# EAGLE design power-control (EAGLE 6.4)
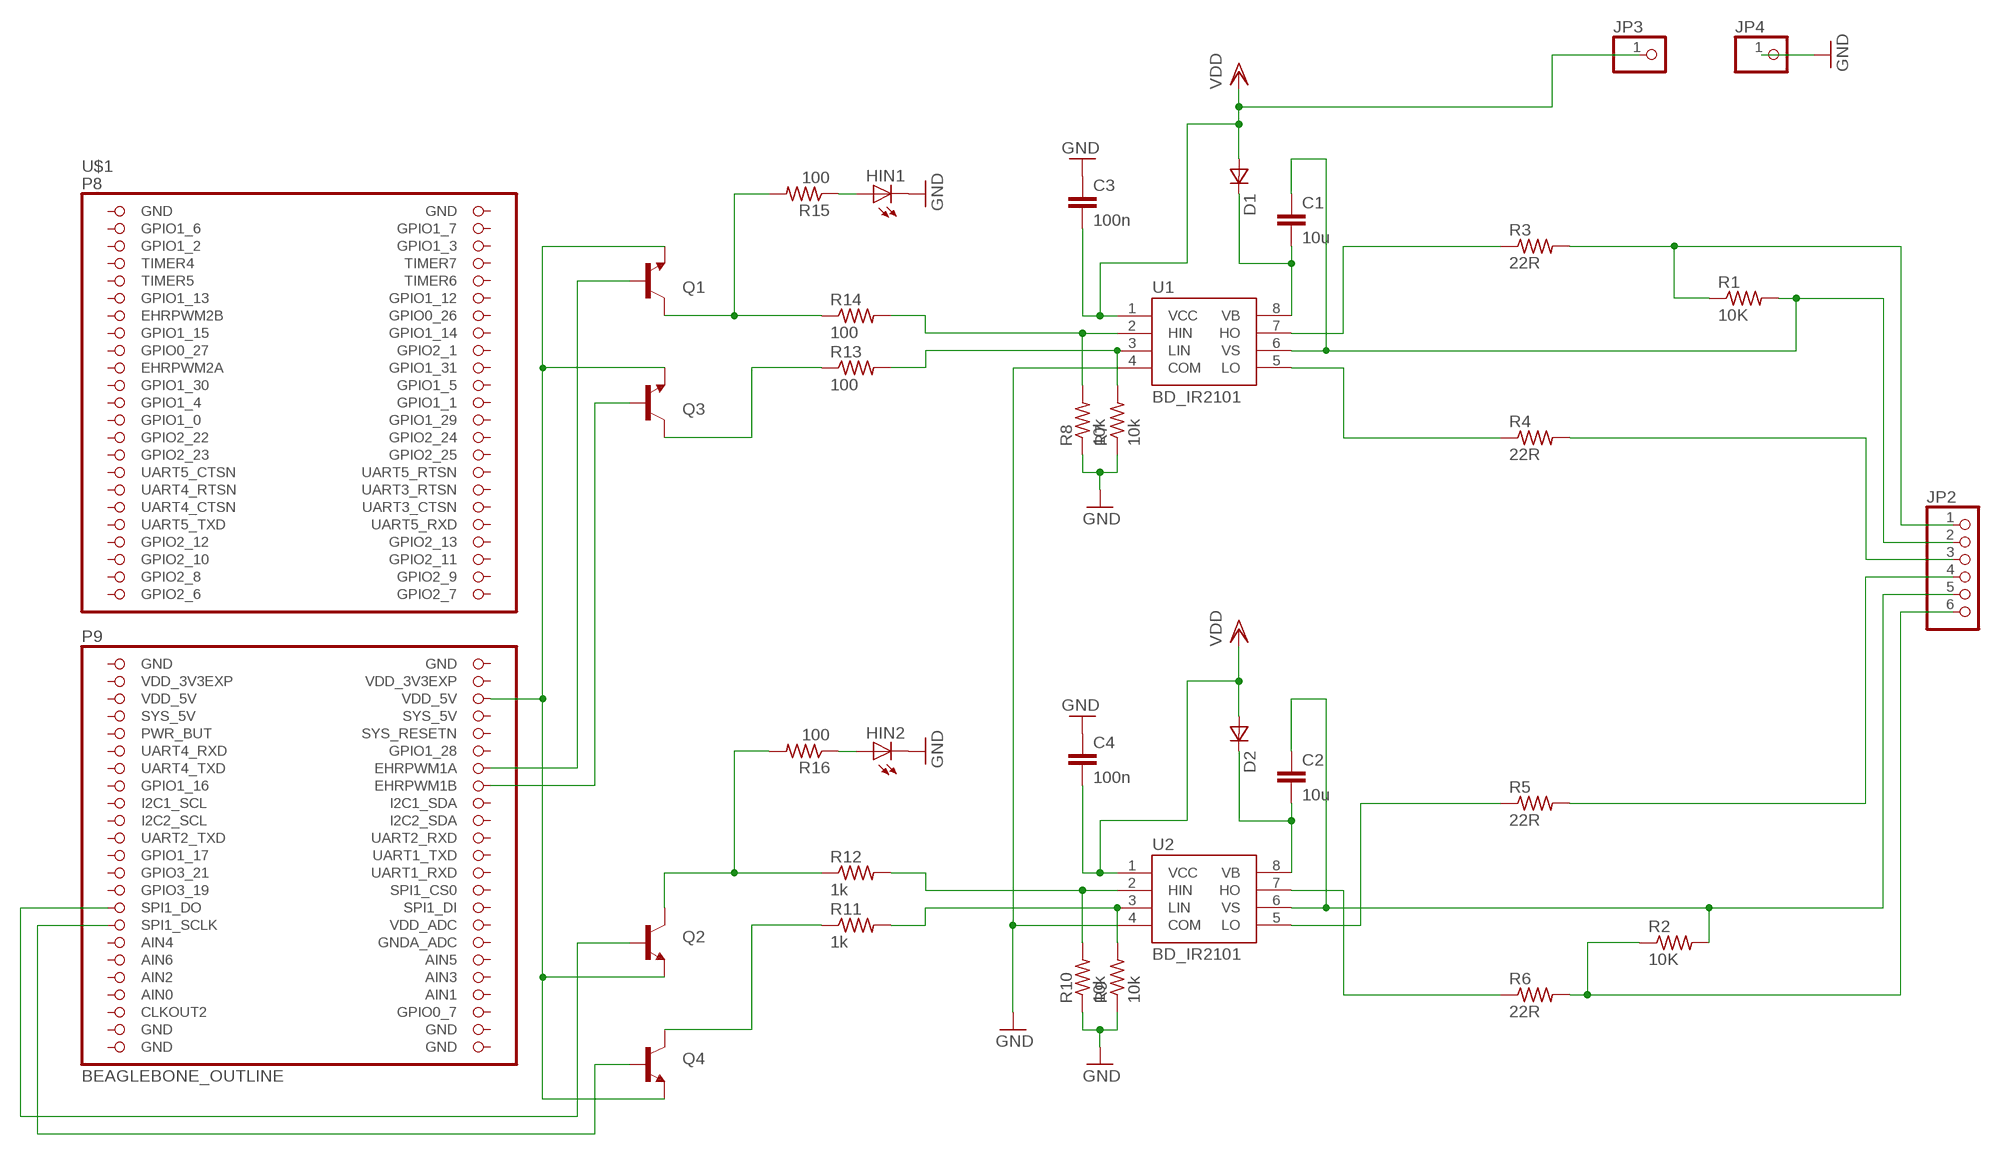
[diagram p0: schematic, sheet 1]

## Parts
C1  10u  C-EUC0603  [C0603]
C2  10u  C-EUC0603  [C0603]
C3  100n  C-EUC0603  [C0603]
C4  100n  C-EUC0603  [C0603]
D1  DSOT23  [SOT-23]
D2  DSOT23  [SOT-23]
HIN1  LEDCHIPLED_0603  [CHIPLED_0603]
HIN2  LEDCHIPLED_0603  [CHIPLED_0603]
JP2  PINHD-1X6  [1X06]
JP3  PINHD-1X1  [1X01]
JP4  PINHD-1X1  [1X01]
Q1  TRANSISTOR_NPNSOT23-3  [SOT23-3]
Q2  TRANSISTOR_NPNSOT23-3  [SOT23-3]
Q3  TRANSISTOR_NPNSOT23-3  [SOT23-3]
Q4  TRANSISTOR_NPNSOT23-3  [SOT23-3]
R1  10K  R-US_R0603  [R0603]
R2  10K  R-US_R0603  [R0603]
R3  22R  R-US_R0603  [R0603]
R4  22R  R-US_R0603  [R0603]
R5  22R  R-US_R0603  [R0603]
R6  22R  R-US_R0603  [R0603]
R7  10k  R-US_R0603  [R0603]
R8  10k  R-US_R0603  [R0603]
R9  10k  R-US_R0603  [R0603]
R10  10k  R-US_R0603  [R0603]
R11  1k  R-US_R0603  [R0603]
R12  1k  R-US_R0603  [R0603]
R13  100  R-US_R0603  [R0603]
R14  100  R-US_R0603  [R0603]
R15  100  R-US_R0603  [R0603]
R16  100  R-US_R0603  [R0603]
U1  BD_IR2101  [SO8]
U2  BD_IR2101  [SO8]
U$1  BEAGLEBONE_OUTLINE  [BEAGLEBONE_SHIELD]

## Nets
GND: C3.1 C4.1 HIN1.C HIN2.C JP4.1 R7.1 R8.1 R9.1 R10.1 U1.4(COM) U2.4(COM)
HO_1: R3.1 U1.7(HO)
HO_2: R6.1 U2.7(HO)
LO_1: R4.1 U1.5(LO)
LO_2: R5.1 U2.5(LO)
MOTOR_OUT_1: C1.1 JP2.2 R1.2 U1.6(VS)
MOTOR_OUT_2: C2.1 JP2.5 R2.2 U2.6(VS)
N$1: Q1.1(B) U$1.60(EHRPWM1A)
N$2: Q4.1(B) U$1.77(SPI1_SCLK)
N$3: R8.2 R14.2 U1.2(HIN)
N$4: R7.2 R13.2 U1.3(LIN)
N$5: R10.2 R12.2 U2.2(HIN)
N$6: R9.2 R11.2 U2.3(LIN)
N$7: C1.2 D1.1(C) U1.8(VB)
N$8: C2.2 D2.1(C) U2.8(VB)
N$10: JP2.4 R5.2
N$11: Q3.3(C) R13.1
N$12: Q3.1(B) U$1.62(EHRPWM1B)
N$13: Q2.1(B) U$1.75(SPI1_DO)
N$14: HIN1.A R15.1
N$15: JP2.1 R1.1 R3.2
N$16: HIN2.A R16.1
N$17: Q2.3(C) R12.1 R16.2
N$18: Q1.3(C) R14.1 R15.2
N$19: Q4.3(C) R11.1
N$20: JP2.3 R4.2
N$21: Q1.2(E) Q2.2(E) Q3.2(E) Q4.2(E) U$1.52(VDD_5V)
N$25: JP2.6 R2.1 R6.2
VDD: C3.2 C4.2 D1.3(A) D2.3(A) JP3.1 U1.1(VCC) U2.1(VCC)
Unconnected: U$1.3(GPIO1_6) U$1.4(GPIO1_7) U$1.5(GPIO1_2) U$1.6(GPIO1_3) U$1.7(TIMER4) U$1.8(TIMER7) U$1.9(TIMER5) U$1.10(TIMER6) U$1.11(GPIO1_13) U$1.12(GPIO1_12) U$1.13(EHRPWM2B) U$1.14(GPIO0_26) U$1.15(GPIO1_15) U$1.16(GPIO1_14) U$1.17(GPIO0_27) U$1.18(GPIO2_1) U$1.19(EHRPWM2A) U$1.20(GPIO1_31) U$1.21(GPIO1_30) U$1.22(GPIO1_5) U$1.23(GPIO1_4) U$1.24(GPIO1_1) U$1.25(GPIO1_0) U$1.26(GPIO1_29) U$1.27(GPIO2_22) U$1.28(GPIO2_24) U$1.29(GPIO2_23) U$1.30(GPIO2_25) U$1.31(UART5_CTSN) U$1.32(UART5_RTSN) U$1.33(UART4_RTSN) U$1.34(UART3_RTSN) U$1.35(UART4_CTSN) U$1.36(UART3_CTSN) U$1.37(UART5_TXD) U$1.38(UART5_RXD) U$1.39(GPIO2_12) U$1.40(GPIO2_13) U$1.41(GPIO2_10) U$1.42(GPIO2_11) U$1.43(GPIO2_8) U$1.44(GPIO2_9) U$1.45(GPIO2_6) U$1.46(GPIO2_7) U$1.54(SYS_5V) U$1.55(PWR_BUT) U$1.56(SYS_RESETN) U$1.57(UART4_RXD) U$1.58(GPIO1_28) U$1.59(UART4_TXD) U$1.61(GPIO1_16) U$1.63(I2C1_SCL) U$1.64(I2C1_SDA) U$1.65(I2C2_SCL) U$1.66(I2C2_SDA) U$1.67(UART2_TXD) U$1.68(UART2_RXD) U$1.69(GPIO1_17) U$1.70(UART1_TXD) U$1.71(GPIO3_21) U$1.72(UART1_RXD) U$1.73(GPIO3_19) U$1.74(SPI1_CS0) U$1.76(SPI1_DI) U$1.78(VDD_ADC) U$1.79(AIN4) U$1.80(GNDA_ADC) U$1.81(AIN6) U$1.82(AIN5) U$1.83(AIN2) U$1.84(AIN3) U$1.86(AIN1) U$1.87(CLKOUT2) U$1.88(GPIO0_7)

## Power pins joined to a net without a drawn wire
AIN0: U$1.85(AIN0)
GND: U$1.1(GND) U$1.2(GND) U$1.47(GND) U$1.48(GND) U$1.89(GND) U$1.90(GND) U$1.91(GND) U$1.92(GND)
SYS_5V: U$1.53(SYS_5V)
VDD_3V3EXP: U$1.49(VDD_3V3EXP) U$1.50(VDD_3V3EXP)
VDD_5V: U$1.51(VDD_5V)

## Library data of the parts
C1-C4 = rcl:C-EU: CAPACITOR, European symbol
D1 D2 = zetex:D: DIODE; MPN: CDSOT23-T03; OC_FARNELL: 1824866; OC_NEWARK: 75K7096
HIN1 HIN2 = adafruit:LED: LED OSRAM: - CHIPLED LG R971, LG N971, LY N971, LG Q971, LY Q971, LO R971, LY R971 LH N974, LH R974 LS Q976, LO Q976, LY Q976 LO Q996 - Hyper CHIPLED LW Q18S LB Q993, LB Q99A, LB R99A - SideLED LS A670, LO A670, LY A670, LG A670, LP A670 LB A673, LV A673, LT A673, LW A673 LH A674 LY A675 LS A676, LA A676, LO A676, LY A676, LW A676 LS A679, LY A679, LG A679 - Hyper Micro SIDELED® LS Y876, LA Y876, LO Y876, LY Y876 LT Y87S - SmartLED LW L88C, LW L88S LB L89C, LB L89S, LG L890 LS L89K, LO L89K, LY L89K LS L896, LA L896, LO L896, LY L896 - TOPLED LS T670, LO T670, LY T670, LG T670, LP T670 LSG T670, LSP T670, LSY T670, LOP T670, LYG T670 LG T671, LOG T671, LSG T671 LB T673, LV T673, LT T673, LW T673 LH T674 LS T676, LA T676, LO T676, LY T676, LB T676, LH T676, LSB T676, LW T676 LB T67C, LV T67C, LT T67C, LS T67K, LO T67K, LY T67K, LW E67C LS E67B, LA E67B, LO E67B, LY E67B, LB E67C, LV E67C, LT E67C LW T67C LS T679, LY T679, LG T679 LS T770, LO T770, LY T770, LG T770, LP T770 LB T773, LV T773, LT T773, LW T773 LH T774 LS E675, LA E675, LY E675, LS T675 LS T776, LA T776, LO T776, LY T776, LB T776 LHGB T686 LT T68C, LB T68C - Hyper Mini TOPLED® LB M676 - Mini TOPLED Santana® LG M470 LS M47K, LO M47K, LY M47K Source: http://www.osram.convergy.de/
JP2 = pinhead:PINHD-1X6: PIN HEADER
JP3 JP4 = pinhead:PINHD-1X1: PIN HEADER
Q1-Q4 = SparkFun-DiscreteSemi:TRANSISTOR_NPN: Generic NPN BJT MMBT2222A - TRANS-08049 (SOT-23, 1A 40V) MPSA42 - TRANS-09116 (SOT-23, 500mA 300V) MMBT5088LT1G - TRANS-11160 (SOT-23, 50 mA 30V)
R1-R16 = rcl:R-US_: RESISTOR, American symbol
U1 U2 = open-bldc:BD
U$1 = adafruit:BEAGLEBONE_OUTLINE: Should match A3 pinout - but not completely tested

## Board
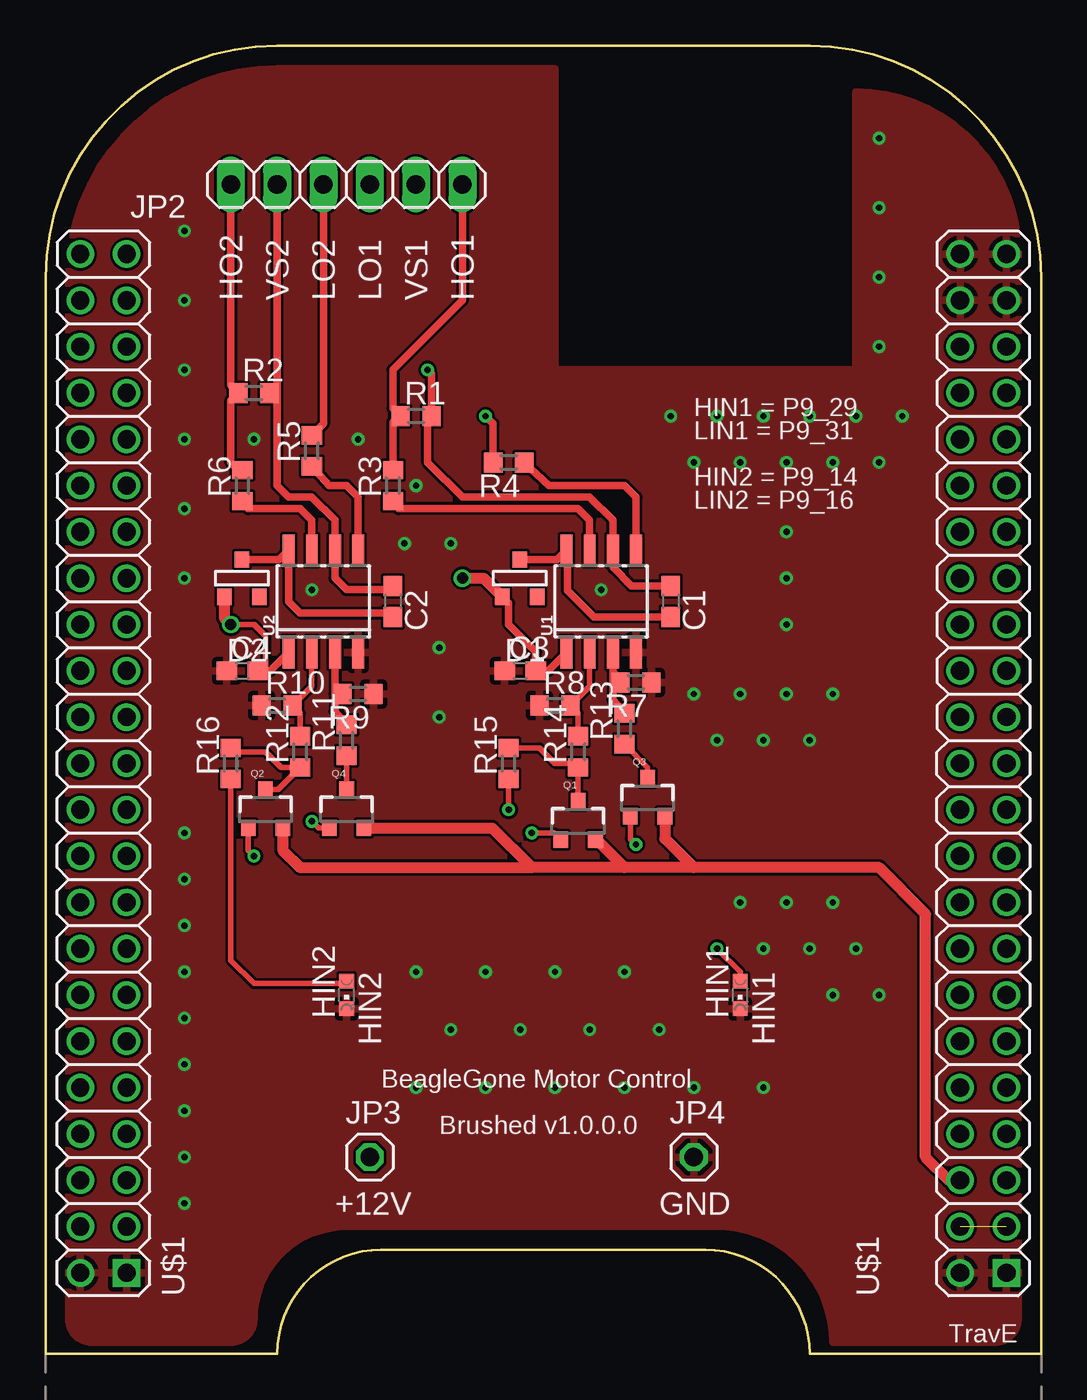
[diagram p1: board, top side]
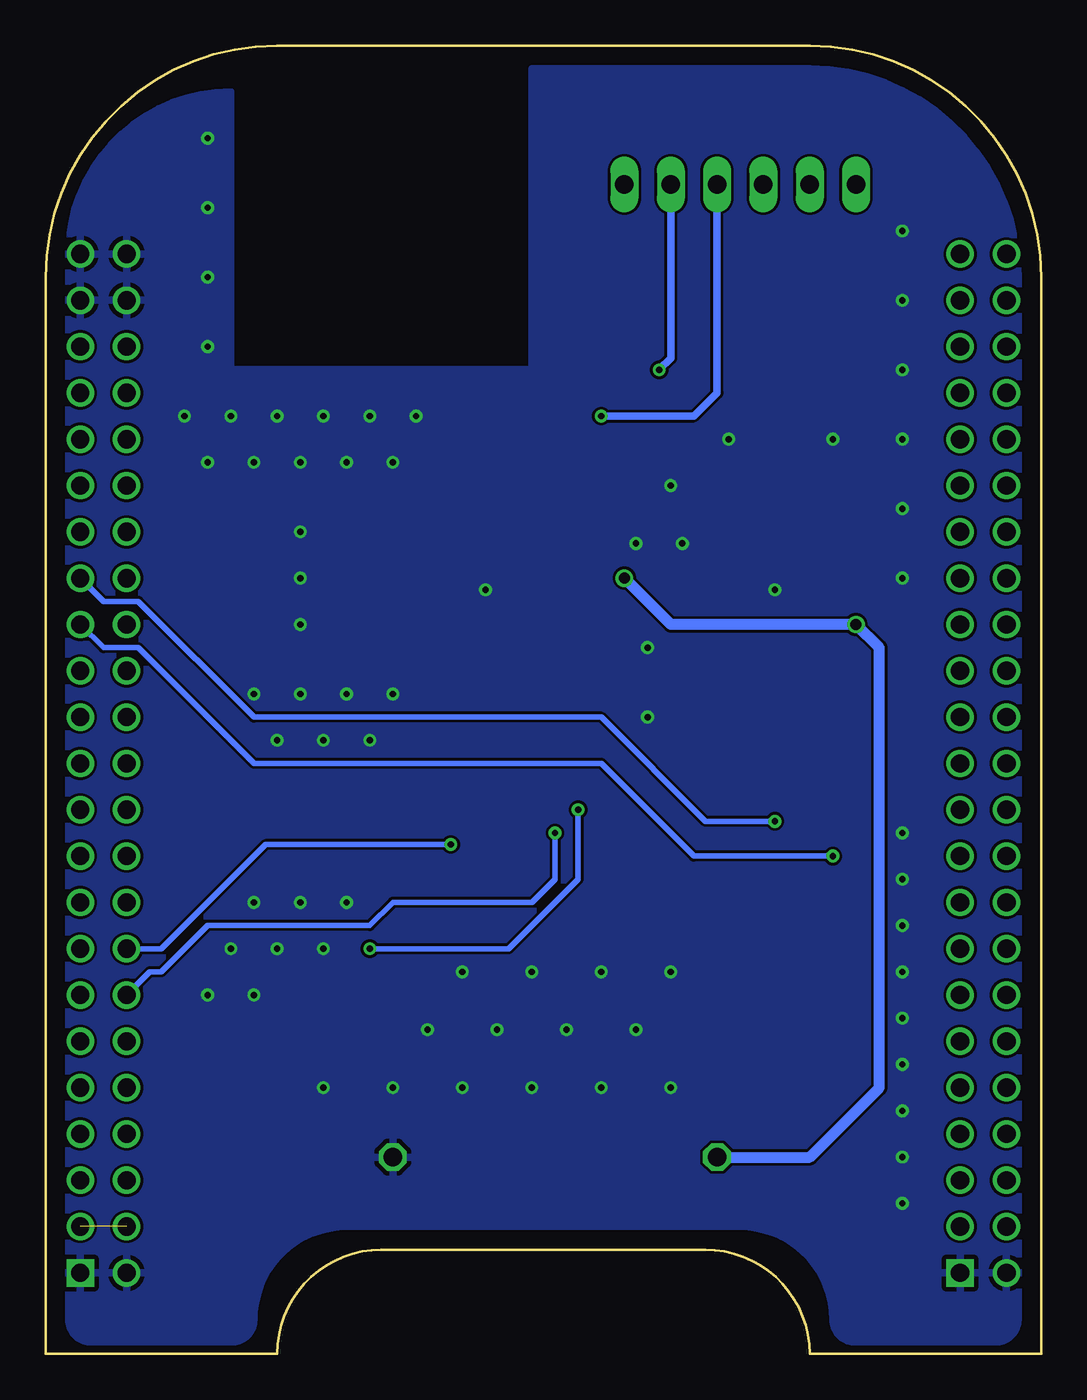
[diagram p2: board, bottom side, seen from below]

Size 54.61 x 71.76 mm. Coordinates in mm from the lower left corner, seen from the top.
Copper layers (1*16): Top 0.0356mm / dielectric 1.5011mm / Bottom 0.0356mm
Design rules "LaenPCBOrder *": minimum track width 6mil, minimum drill 13mil, track to track 6mil, track to pad 6mil, pad to pad 6mil, via to via 6mil, smd to smd 6mil, copper to edge 15mil, drill to drill 6mil, minimum pad ring 7mil, minimum via ring 7mil, stop-mask expansion 4mil, vias tented up to drill 14mil, thermal gap 10mil

### Footprints (pad centres in the part's own frame; a part is rotated, then mirrored left to right if it is on the bottom)
C0603 = smd 1.1 x 1: 1 -0.85,0; 2 0.85,0
SOT-23 = smd 0.787 x 0.889: 1 0.025,-1.016; 2 -0.94,1.016; 3 0.991,1.016
CHIPLED_0603 = smd 0.8 x 0.8: A 0,-0.75; C 0,0.75
1X06 = drill 1.016 long: 1 -6.35,0; 2 -3.81,0; 3 -1.27,0; 4 1.27,0; 5 3.81,0; 6 6.35,0
1X01 = drill 1.016 octagon: 1 0,0
SOT23-3 = smd 0.8 x 0.9: 1 -0.95,-1; 2 0.95,-1; 3 0,1.1
R0603 = smd 1 x 1.1: 1 -0.85,0; 2 0.85,0
SO8 = smd 0.65 x 1.75: 1 -1.905,-2.8; 2 -0.635,-2.8; 3 0.635,-2.8; 4 1.905,-2.8; 5 1.905,2.8; 6 0.635,2.8; 7 -0.635,2.8; 8 -1.905,2.8
BEAGLEBONE_SHIELD = drill 1 square: 1 4.445,19.05; 47 52.705,19.05 | drill 1: 2 1.905,19.05; 3 4.445,21.59; 4 1.905,21.59; 5 4.445,24.13; 6 1.905,24.13; 7 4.445,26.67; 8 1.905,26.67; 9 4.445,29.21; 10 1.905,29.21; 11 4.445,31.75; 12 1.905,31.75; 13 4.445,34.29; 14 1.905,34.29; 15 4.445,36.83; 16 1.905,36.83; 17 4.445,39.37; 18 1.905,39.37; 19 4.445,41.91; 20 1.905,41.91; 21 4.445,44.45; 22 1.905,44.45; 23 4.445,46.99; 24 1.905,46.99; 25 4.445,49.53; 26 1.905,49.53; 27 4.445,52.07; 28 1.905,52.07; 29 4.445,54.61; 30 1.905,54.61; 31 4.445,57.15; 32 1.905,57.15; 33 4.445,59.69; 34 1.905,59.69; 35 4.445,62.23; 36 1.905,62.23; 37 4.445,64.77; 38 1.905,64.77; 39 4.445,67.31; 40 1.905,67.31; 41 4.445,69.85; 42 1.905,69.85; 43 4.445,72.39; 44 1.905,72.39; 45 4.445,74.93; 46 1.905,74.93; 48 50.165,19.05; 49 52.705,21.59; 50 50.165,21.59; 51 52.705,24.13; 52 50.165,24.13; 53 52.705,26.67; 54 50.165,26.67; 55 52.705,29.21; 56 50.165,29.21; 57 52.705,31.75; 58 50.165,31.75; 59 52.705,34.29; 60 50.165,34.29; 61 52.705,36.83; 62 50.165,36.83; 63 52.705,39.37; 64 50.165,39.37; 65 52.705,41.91; 66 50.165,41.91; 67 52.705,44.45; 68 50.165,44.45; 69 52.705,46.99; 70 50.165,46.99; 71 52.705,49.53; 72 50.165,49.53; 73 52.705,52.07; 74 50.165,52.07; 75 52.705,54.61; 76 50.165,54.61; 77 52.705,57.15; 78 50.165,57.15; 79 52.705,59.69; 80 50.165,59.69; 81 52.705,62.23; 82 50.165,62.23; 83 52.705,64.77; 84 50.165,64.77; 85 52.705,67.31; 86 50.165,67.31; 87 52.705,69.85; 88 50.165,69.85; 89 52.705,72.39; 90 50.165,72.39; 91 52.705,74.93; 92 50.165,74.93

### Placement (x,y rotation side)
C1  34.29,41.27 270 top
C2  19.05,41.27 270 top
C3  26.04,37.46 0 top
C4  10.8,37.46 0 top
D1  26.04,42.54 180 top
D2  10.8,42.54 180 top
HIN1  38.1,19.69 180 top
HIN2  16.51,19.69 180 top
JP2  16.51,64.14 180 top
JP3  17.78,10.79 0 top
JP4  35.56,10.79 0 top
Q1  29.21,29.21 0 top
Q2  12.07,29.84 0 top
Q3  33.02,30.48 0 top
Q4  16.51,29.84 0 top
R1  20.32,51.43 0 top
R2  11.43,52.7 0 top
R3  19.05,47.62 90 top
R4  25.4,48.89 180 top
R5  14.61,49.53 90 top
R6  10.8,47.62 90 top
R7  32.39,36.83 180 top
R8  27.94,35.56 0 top
R9  17.14,36.2 180 top
R10  12.7,35.56 0 top
R11  16.51,33.65 90 top
R12  13.97,33.02 90 top
R13  31.75,34.29 90 top
R14  29.21,33.02 90 top
R15  25.4,32.38 90 top
R16  10.16,32.38 90 top
U1  30.48,41.27 0 top
U2  15.24,41.27 0 top
U$1  0,-14.61 0 top

### Tracks (layer width: path | path; a pad name or v marks a point on that pad's centre or on a via)
GND  (via drill 0.35)
  other vias: 11.43,50.16 14.61,41.91 20.32,47.62 30.48,41.91 17.14,50.16 35.56,48.89 34.29,51.43 36.83,51.43 38.1,48.89 39.37,51.43 40.64,48.89 41.91,51.43 43.18,48.89 44.45,51.43 45.72,48.89 46.99,51.43 40.64,45.09 40.64,42.54 40.64,40 35.56,36.2 38.1,36.2 40.64,36.2 43.18,36.2 36.83,33.65 39.37,33.65 41.91,33.65 38.1,24.77 39.37,22.23 40.64,24.77 41.91,22.23 43.18,19.69 45.72,19.69 44.45,22.23 43.18,24.77 20.32,20.95 20.32,14.6 22.23,17.78 24.13,20.95 24.13,14.6 26.04,17.78 27.94,20.95 27.94,14.6 29.84,17.78 31.75,20.95 31.75,14.6 33.66,17.78 35.56,14.6 39.37,14.6 21.59,38.73 21.59,34.92 7.62,28.57 7.62,26.03 7.62,23.49 7.62,20.95 7.62,18.41 7.62,15.87 7.62,13.33 7.62,10.79 7.62,8.26 19.69,44.45 22.23,44.45 7.62,61.59 7.62,57.79 7.62,53.97 7.62,50.16 7.62,46.35 7.62,42.54 45.72,66.68 45.72,62.87 45.72,59.05 45.72,55.24
  pour Bottom: 20.32,70.48 12.7,70.48 arc90 1.27,59.05 1.27,1.9 arc90 2.54,0.63 10.16,0.63 arc90 11.43,1.9 arc-90 16.51,6.98 38.1,6.98 arc-90 43.18,1.9 arc90 44.45,0.63 52.07,0.63 arc90 53.34,1.9 53.34,60.32 arc90 44.45,69.22 44.45,53.97 27.94,53.97 27.94,70.48
  pour Top: 19.05,70.48 12.7,70.48 arc90 1.27,59.05 1.27,1.9 arc90 2.54,0.63 10.16,0.63 arc90 11.43,1.9 arc-90 16.51,6.98 36.83,6.98 arc-90 43.18,0.63 52.07,0.63 arc90 53.34,1.9 53.34,60.32 arc90 44.45,69.22 44.45,53.97 27.94,53.97 27.94,70.48
HO_1
  Top 0.406: U1.7 29.84,45.72 29.21,46.35 19.37,46.35 R3.1
HO_2
  Top 0.406: U2.7 14.61,45.72 13.97,46.35 11.12,46.35 R6.1
LO_1
  Top 0.406: U1.5 32.39,46.99 31.75,47.62 27.62,47.62 R4.1
LO_2
  Top 0.406: U2.5 17.14,46.99 16.51,47.62 15.56,47.62 R5.1
MOTOR_OUT_1  (via drill 0.35)
  Top 0.406: C1.1 32.13,42.12 31.14,43.12 31.14,44.05 U1.6 31.12,45.72 29.84,46.99 22.86,46.99 20.96,48.89 20.96,51.12 R1.2 21.17,53.76 v20.96,53.97
  Bottom 0.406: v20.96,53.97 20.32,54.61 JP2.2
MOTOR_OUT_2
  Top 0.406: C2.1 18.84,41.91 16.51,41.91 15.88,42.54 U2.6 15.88,45.72 14.61,46.99 13.34,46.99 12.7,47.62 12.7,52.38 | 12.7,52.38 R2.2 | 12.7,52.38 JP2.5
N$1  (via drill 0.35)
  Top 0.305: Q1.1 27.9,28.57 v26.67,28.57
  Bottom 0.305: v26.67,28.57 26.67,26.03 27.94,24.77 35.56,24.77 36.83,23.49 45.72,23.49 48.26,20.95 48.89,20.95 U$1.60
N$2  (via drill 0.35)
  Top 0.305: Q4.1 14.97,28.84 v14.61,29.21
  Bottom 0.305: v14.61,29.21 18.42,29.21 24.13,34.92 43.18,34.92 49.53,41.27 51.44,41.27 U$1.77
N$3
  Top 0.305: R14.2 29.21,35.14 R8.2 29.84,36.61 U1.2
N$4
  Top 0.305: R7.2 31.54,37.04 31.12,37.46
  Top 0.406: U1.3 31.12,37.46 31.12,35.88 R13.2
N$5
  Top 0.305: R12.2 13.97,35.14 R10.2 14.61,36.61 U2.2
N$6
  Top 0.305: R9.2 15.88,36.2
  Top 0.406: U2.3 15.88,36.2 15.88,35.24 R11.2
N$7
  Top 0.406: C1.2 30.08,40.42 28.62,41.88 28.62,44.03 U1.8 28.06,43.56 D1.1
N$8
  Top 0.406: D2.1 12.82,43.56 U2.8 13.34,41.27 13.97,40.64 18.84,40.64 C2.2
N$10
  Top 0.406: JP2.4 15.24,51.02 R5.2
N$11
  Top 0.305: Q3.3 33.02,32.17 R13.1
N$12  (via drill 0.35)
  Top 0.305: Q3.1 32.07,28.25 v32.39,27.94
  Bottom 0.305: v32.39,27.94 42.55,27.94 48.26,22.23 U$1.62
N$13  (via drill 0.35)
  Top 0.305: Q2.1 11.12,27.62 v11.43,27.3
  Bottom 0.305: v11.43,27.3 19.05,27.3 24.13,32.38 43.18,32.38 49.53,38.73 51.44,38.73 U$1.75
N$14  (via drill 0.35)
  Top 0.305: R15.1 v25.4,29.84 | v36.83,22.23 38.1,20.95 HIN1.A
  Bottom 0.305: v25.4,29.84 25.4,26.03 29.21,22.23 v36.83,22.23
N$15
  Top 0.406: R3.2 19.05,51.11 R1.1 19.05,51.85 19.05,53.97 22.86,57.79 JP2.1
N$16
  Top 0.305: R16.1 10.16,21.59 11.43,20.32 16.39,20.32 HIN2.A
N$17
  Top 0.305: Q2.3 12.75,30.95 R12.1 12.92,32.17 12.07,33.02 10.38,33.02 R16.2
N$18
  Top 0.305: Q1.3 R14.1 29,32.38 27.94,32.38 27.09,33.23 R15.2
N$19
  Top 0.305: Q4.3 R11.1
N$20  (via drill 0.35)
  Top 0.406: R4.2 24.55,51.02 v24.13,51.43
  Bottom 0.406: v24.13,51.43 19.05,51.43 17.78,52.7 JP2.3
N$21
  Top 0.61: U$1.52 49.53,9.53 48.26,10.79 48.26,24.13 45.72,26.67 35.56,26.67 | Q4.2 24.5,28.84 26.67,26.67 | Q2.2 13.02,27.62 13.97,26.67 26.67,26.67 | 35.56,26.67 31.75,26.67 | 31.75,26.67 26.67,26.67 | Q1.2 30.21,28.21 31.75,26.67 | Q3.2 33.97,28.26 35.56,26.67
N$25
  Top 0.406: 10.8,52.39 R2.1 | R6.2 10.58,48.47 10.16,48.89 10.16,52.28 R2.1 | JP2.6 10.16,53.12 R2.1
VDD  (via drill 0.6)
  Top 0.305: v10.16,40 11.43,40 12.07,39.37 12.07,37.88 C4.2
  Top 0.406: C4.2 12.33,37.46 U2.1 | U1.1 27.57,37.46 C3.2 26.89,38.52 25.4,40 25.4,41.17 D1.3
  Top 0.61: v22.86,42.54 24.03,42.54 D1.3 | D2.3 9.8,40.36 v10.16,40
  Bottom 0.61: v22.86,42.54 20.32,40 v10.16,40 8.89,38.73 8.89,14.6 12.7,10.79 JP3.1
VDD_3V3EXP  (1 unrouted)

### Text on the board
tPlace: HO2 | VS2 | LO2 | LO1 | VS1 | HO1 | HIN1 = P9_29 | LIN1 = P9_31 | HIN2 = P9_14 | LIN2 = P9_16 | - BC846 Transistor | 4 | - RES 100 0805 | 2 | - LED BLUE 0805 | 2 | HIN2 | HIN1 | BeagleGone Motor Control | Brushed v1.0.0.0 | +12V | GND | TravE
tDocu: Components: | - IR2101 | 2 | - RES 1k 0805 | 4 | - RES 10k 0805 | 4 | - RES 10k 0603 | 2 | - RES 22 0805 | 4 | - CAP 100nF 0805 | 2 | - CAP 10uF 0805 | 2 | - PINHEAD 1X6 | 1 | - PINHEAD 1X1 | 2 | - DIODE SOT23 | 2